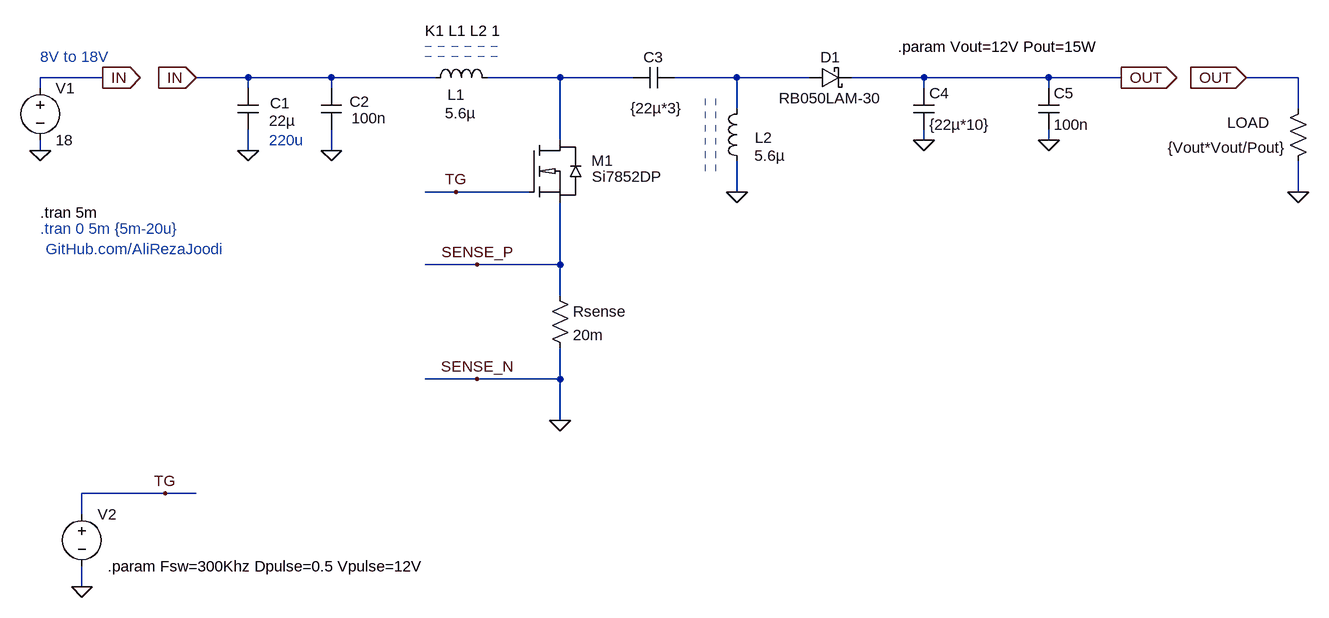
[diagram p0: schematic _PowerStage.asc]
_PowerStage.asc, the LTspice schematic file:
Version 4.1
SHEET 1 3620 1972
WIRE 1440 -400 1344 -400
WIRE 1664 -400 1584 -400
WIRE 1792 -400 1664 -400
WIRE 1952 -400 1792 -400
WIRE 2144 -400 2032 -400
WIRE 2256 -400 2144 -400
WIRE 2416 -400 2320 -400
WIRE 2528 -400 2416 -400
WIRE 2704 -400 2592 -400
WIRE 2896 -400 2704 -400
WIRE 3008 -400 2896 -400
WIRE 3280 -400 3200 -400
WIRE 1344 -384 1344 -400
WIRE 1664 -384 1664 -400
WIRE 1792 -384 1792 -400
WIRE 2704 -384 2704 -400
WIRE 2896 -384 2896 -400
WIRE 2416 -352 2416 -400
WIRE 3280 -352 3280 -400
WIRE 2144 -304 2144 -400
WIRE 2704 -304 2704 -320
WIRE 2896 -304 2896 -320
WIRE 1344 -288 1344 -304
WIRE 1664 -288 1664 -320
WIRE 1792 -288 1792 -320
WIRE 1984 -224 1936 -224
WIRE 2096 -224 1984 -224
WIRE 2416 -224 2416 -272
WIRE 3280 -224 3280 -272
WIRE 2016 -112 1936 -112
WIRE 2144 -112 2016 -112
WIRE 2144 -112 2144 -208
WIRE 2144 -64 2144 -112
WIRE 2016 64 1936 64
WIRE 2144 64 2016 64
WIRE 2144 64 2144 16
WIRE 2144 128 2144 64
WIRE 1536 240 1408 240
WIRE 1584 240 1536 240
WIRE 1408 272 1408 240
WIRE 1408 384 1408 352
FLAG 2704 -304 0
FLAG 3280 -224 0
FLAG 1344 -288 0
FLAG 3008 -400 OUT
IOPIN 3008 -400 Out
FLAG 1440 -400 IN
IOPIN 1440 -400 Out
FLAG 1792 -288 0
FLAG 2896 -304 0
FLAG 2016 -112 SENSE_P
FLAG 2016 64 SENSE_N
FLAG 1984 -224 TG
FLAG 1664 -288 0
FLAG 2144 128 0
FLAG 2416 -224 0
FLAG 1584 -400 IN
IOPIN 1584 -400 In
FLAG 3200 -400 OUT
IOPIN 3200 -400 In
FLAG 1408 384 0
FLAG 1536 240 TG
SYMBOL schottky 2528 -416 M90
WINDOW 0 0 32 VBottom 2
WINDOW 3 32 32 VTop 2
SYMATTR InstName D1
SYMATTR Value RB050LAM-30
SYMATTR Description Diode
SYMATTR Type diode
SYMBOL ind 1936 -384 R270
WINDOW 0 -26 48 VTop 2
WINDOW 3 -23 55 VBottom 2
SYMATTR InstName L1
SYMATTR Value 5.6µ
SYMATTR SpiceLine Rser=47m
SYMATTR Type ind
SYMBOL res 2128 -80 R0
SYMATTR InstName Rsense
SYMATTR Value 20m
SYMBOL voltage 1344 -400 R0
WINDOW 123 24 138 Left 2
WINDOW 39 24 117 Left 2
SYMATTR Value 18
SYMATTR InstName V1
SYMBOL res 3296 -368 M0
WINDOW 0 60 37 Left 2
SYMATTR InstName LOAD
SYMATTR Value {Vout*Vout/Pout}
SYMBOL cap 1776 -384 R0
WINDOW 0 44 21 Left 2
WINDOW 3 47 46 Left 2
SYMATTR InstName C2
SYMATTR Value 100n
SYMBOL cap 1648 -384 R0
WINDOW 0 50 23 Left 2
WINDOW 3 48 50 Left 2
SYMATTR InstName C1
SYMATTR Value 22µ
SYMBOL cap 2880 -384 R0
SYMATTR InstName C5
SYMATTR Value 100n
SYMBOL cap 2688 -384 R0
SYMATTR InstName C4
SYMATTR Value {22µ*10}
SYMBOL cap 2256 -384 R270
WINDOW 0 32 32 VTop 2
WINDOW 3 -15 36 VBottom 2
SYMATTR InstName C3
SYMATTR Value {22µ*3}
SYMATTR SpiceLine Rser=0.01
SYMBOL ind 2432 -256 R180
WINDOW 0 -39 52 Left 2
WINDOW 3 -11 24 Right 2
SYMATTR InstName L2
SYMATTR Value 5.6µ
SYMATTR SpiceLine Rser=47m
SYMATTR Type ind
SYMBOL MyLib\\Transistor_MOSFET_N\\NMOS 2096 -304 R0
SYMATTR InstName M1
SYMATTR SpiceModel Si7852DP
SYMBOL voltage 1408 256 R0
WINDOW 3 41 64 Invisible 2
WINDOW 123 0 0 Left 0
SYMATTR Value PULSE(0 {Vpulse} 0 {0.01/Fsw} {0.01/Fsw} {Dpulse/Fsw} {1/Fsw})
SYMATTR SpiceLine Rser=10
SYMATTR InstName V2
TEXT 1344 -192 Left 2 !.tran 5m
TEXT 1352 -136 Left 2 ;GitHub.com/AliRezaJoodi
TEXT 1936 -472 Left 2 !K1 L1 L2 1
TEXT 1696 -304 Left 2 ;220u
TEXT 2664 -448 Left 2 !.param Vout=12V Pout=15W
TEXT 1344 -432 Left 2 ;8V to 18V
TEXT 1344 -168 Left 2 ;.tran 0 5m {5m-20u}
TEXT 1448 352 Left 2 !.param Fsw=300Khz Dpulse=0.5 Vpulse=12V
LINE Normal 2048 -432 1936 -432 2
LINE Normal 2048 -448 1936 -448 2
LINE Normal 2368 -256 2368 -368 2
LINE Normal 2384 -256 2384 -368 2

The netlist it stands for:
* _PowerStage.asc
D1 N002 OUT RB050LAM-30
L1 IN N001 5.6µ Rser=47m
Rsense SENSE_P 0 20m
V1 IN 0 18
R§LOAD OUT 0 {Vout*Vout/Pout}
C2 IN 0 100n
C1 IN 0 22µ
C5 OUT 0 100n
C4 OUT 0 {22µ*10}
C3 N001 N002 {22µ*3} Rser=0.01
L2 0 N002 5.6µ Rser=47m
M1 N001 TG SENSE_P SENSE_P Si7852DP
V2 TG 0 PULSE(0 {Vpulse} 0 {0.01/Fsw} {0.01/Fsw} {Dpulse/Fsw} {1/Fsw}) Rser=10
.model D D
.lib standard.dio
.model NMOS NMOS
.model PMOS PMOS
.lib standard.mos
.tran 5m
* GitHub.com/AliRezaJoodi
K1 L1 L2 1
* 220u
.param Vout=12V Pout=15W
* 8V to 18V
* .tran 0 5m {5m-20u}
.param Fsw=300Khz Dpulse=0.5 Vpulse=12V
.backanno
.end